# EAGLE design OpAmp-Inverting-3Transistor-alt3 (EAGLE 7.6.0)
Build an op amp with three discrete transistors Lyle Williams -December 01, 2011 http://www.edn.com/design/components-and-packaging/4368741/Build-an-op-amp-with-three-discrete-transistors
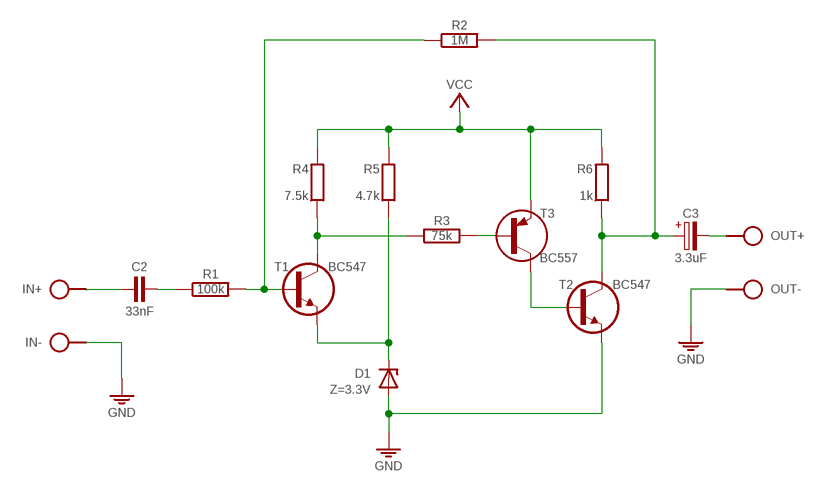
[diagram p0: schematic, sheet 1]

## Parts
C2  33nF  C050-020X044  [C050-020X044]
C3  3.3uF  CPOLE2,5-4/V  [E2.5-4/V]
D1  Z=3.3V  Z-DIODE34Z2,5  [DO34Z2,5]
IN  SPAD+--+  [SPAD-+]
J1  VCC_GNDPWR-R  [PWR-R]
OUT  SPAD+-+-  [SPAD+-]
R1  100k  R-H0202/10-V  [0202/10-V]
R2  1M  R-H0202/10  [0202/10]
R3  75k  R-H0202/7  [0202/7]
R4  7.5k  R0202/7  [0202/7]
R5  4.7k  R0202/7  [0202/7]
R6  1k  R0202/10-V  [0202/10-V]
T1  BC547  BC547CBE  [TO92-CBE]
T2  BC547  BC547CBE  [TO92-CBE]
T3  BC557  BC557CBE  [TO92-CBE]

## Nets
GND: D1.A IN.1 J1.1 OUT.1 T2.E
N$1: D1.C R5.2 T1.E
N$2: R3.1 R4.2 T1.C
N$3: T2.B T3.C
N$4: C2.2 IN.2
N$5: C2.1 R1.1
N$6: R1.2 R2.1 T1.B
N$7: R3.2 T3.B
N$8: C3.+ R2.2 R6.2 T2.C
N$9: C3.- OUT.2
VCC: J1.2 R4.1 R5.1 R6.1 T3.E

## Library data of the parts
C2 = c:C: CAPACITOR, European symbol
C3 = c:CPOL: POLARIZED CAPACITOR, European symbol
D1 = d:Z-DIODE
IN OUT = pad:SPAD+-
J1 = pad:VCC_GND
R1-R3 = r:R-H
R4-R6 = r:R: RESISTOR, European symbol
T1 T2 = t:BC547
T3 = t:BC557

## Board
Build an op amp with three discrete transistors Lyle Williams -December 01, 2011 http://www.edn.com/design/components-and-packaging/4368741/Build-an-op-amp-with-three-discrete-transistors
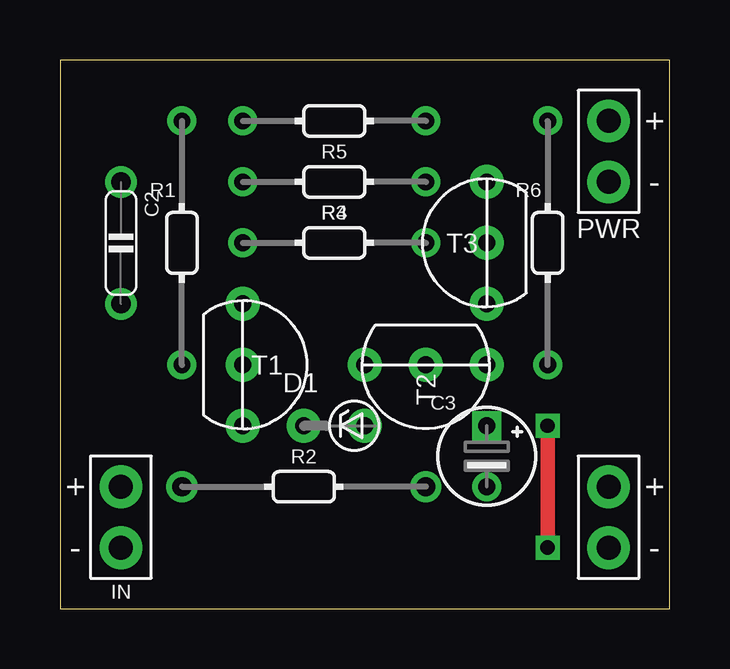
[diagram p1: board, top side]
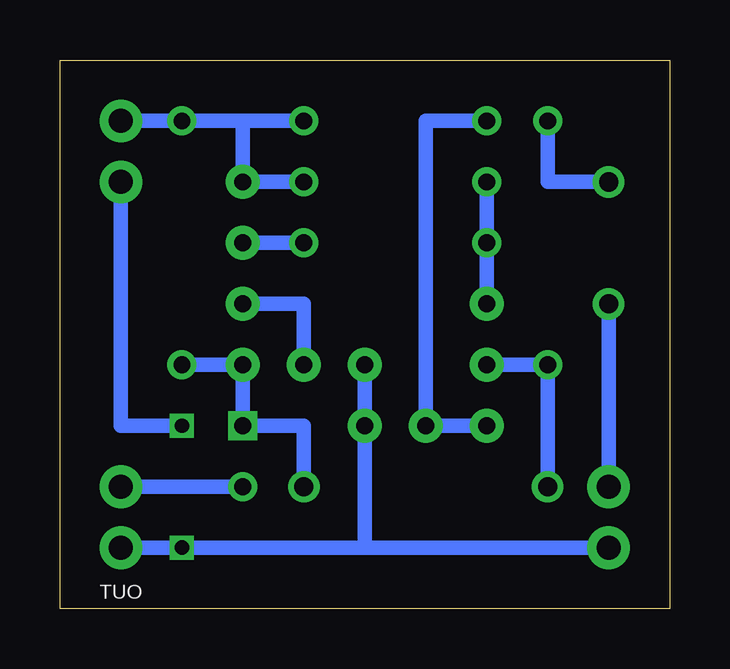
[diagram p2: board, bottom side, seen from below]

Size 25.4 x 22.86 mm. Coordinates in mm from the lower left corner, seen from the top.
Outline: 0,0 25.4,0 25.4,22.86 0,22.86 0,0
Copper layers (1*16): Top 0.035mm / dielectric 1.5mm / Bottom 0.035mm
Design rules "default": minimum track width 10mil, minimum drill 24mil, track to track 8mil, track to pad 8mil, pad to pad 8mil, via to via 8mil, smd to smd 8mil, copper to edge 40mil, drill to drill 8mil, minimum pad ring 10mil, minimum via ring 8mil, stop-mask expansion 4mil, vias tented up to drill 0mil, thermal gap 10mil

### Footprints (pad centres in the part's own frame; a part is rotated, then mirrored left to right if it is on the bottom)
C050-020X044 = drill 0.8: 1 -2.54,0; 2 2.54,0
E2.5-4/V = drill 0.7 square: + 0,1.27 | drill 0.7: - 0,-1.27
DO34Z2,5 = drill 0.7 pad 1.422: A 1.27,0; C -1.27,0
SPAD-+ = drill 1 pad 1.778: 1 0,-1.27; 2 0,1.27
PWR-R = drill 1 pad 1.778: 1 0,-1.27; 2 0,1.27
SPAD+- = drill 1 pad 1.778: 1 0,-1.27; 2 0,1.27
0202/10-V = drill 0.7: 1 0,5.08; 2 0,-5.08
0202/10 = drill 0.8: 1 -5.08,0; 2 5.08,0
0202/7 = drill 0.7: 1 -3.81,0; 2 3.81,0
TO92-CBE = drill 0.7 pad 1.422: B 0,0; C 0,2.54; E 0,-2.54

### Placement (x,y rotation side)
C2  2.54,15.24 270 top
C3  17.78,6.35 0 top
D1  11.43,7.62 0 top
IN  2.54,3.81 0 top
J1  22.86,19.05 0 top
OUT  22.86,3.81 0 top
R1  5.08,15.24 0 top
R2  10.16,5.08 0 top
R3  11.43,15.24 0 top
R4  11.43,17.78 180 top
R5  11.43,20.32 180 top
R6  20.32,15.24 0 top
T1  7.62,10.16 0 top
T2  15.24,10.16 270 top
T3  17.78,15.24 180 top

### Tracks (layer width: path | path; a pad name or v marks a point on that pad's centre or on a via)
GND  (via drill 0.6)
  Top 0.61: v20.32,7.62 v20.32,2.54
  Bottom 0.61: IN.1 v20.32,2.54 | T2.E D1.A 12.7,2.54 v20.32,2.54 | J1.1 22.86,7.62 v20.32,7.62 | OUT.1 v20.32,2.54
N$1
  Bottom 0.61: R5.2 10.16,20.32 D1.C T1.E
N$2
  Bottom 0.61: T1.C R4.2 R3.1
N$3
  Bottom 0.61: T3.C 15.24,12.7 T2.B
N$4
  Bottom 0.61: C2.2 IN.2
N$5
  Bottom 0.61: C2.1 5.08,17.78 R1.1
N$6
  Bottom 0.61: R2.1 R1.2 T1.B
N$7
  Bottom 0.61: T3.B R3.2
N$8
  Bottom 0.61: R2.2 15.24,7.62 C3.+ T2.C R6.2
N$9
  Bottom 0.61: C3.- OUT.2
VCC
  Bottom 0.61: R5.1 17.78,20.32 | 17.78,20.32 T3.E R4.1 | 17.78,20.32 R6.1 J1.2